# Altium project PCB_J-Link OB.PrjPcb
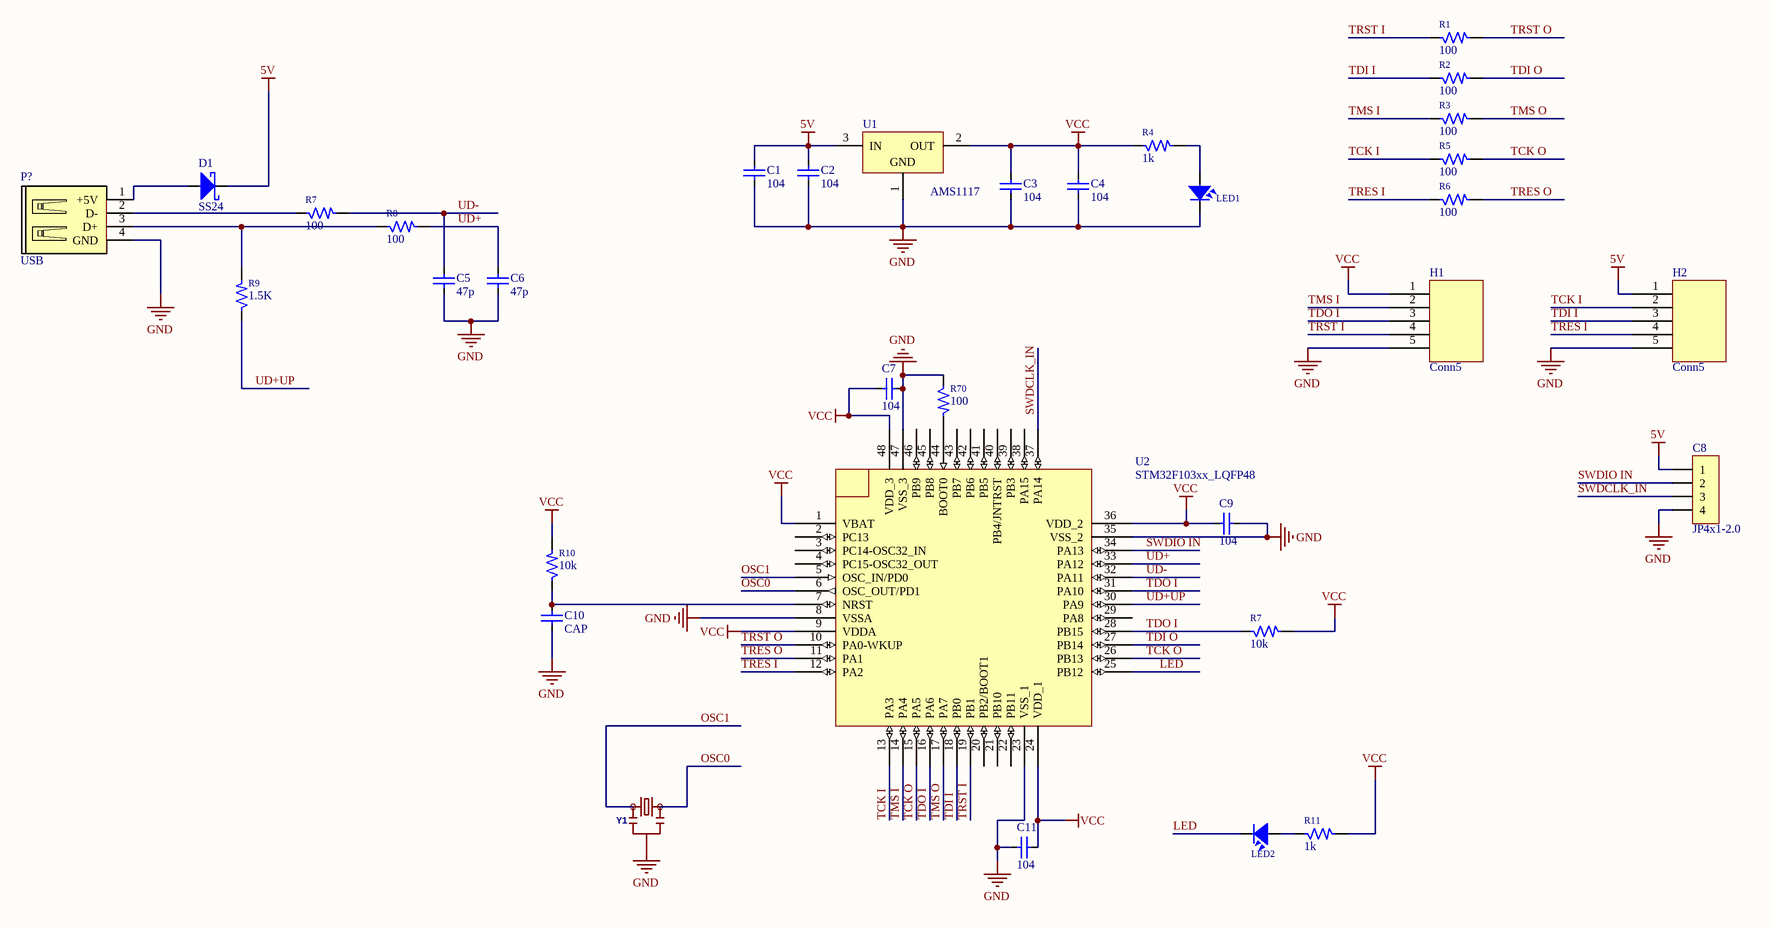
[diagram p0: J-Link OB.SchDoc]
1 sheet, 33 parts. Net scope: global (net labels, ports and power ports of the same name join across sheets).
Board file: J-Link.PcbDoc

## Sheet J-Link OB.SchDoc
size A2

### Parts
(Parts that share a designator on the sheet are numbered #1, #2 ... from top to bottom, then left to right.)
C1  104  [C 0805]
C2  104  [C 0805]
C3  104  [C 0805]
C4  104  [C 0805]
C5  47p  [C 0805]
C6  47p  [C 0805]
C7  104  [C 0805]
C8  JP4x1-2.0  [J4-C1T]
C9  104  [C 0805]
C10  CAP  [C 0805 INSTEK]
C11  104  [C 0805]
D1  SS24  [DO-214AC]
H1  Conn5  [CONN5]
H2  Conn5  [CONN5]
LED1  LED SMD  [SM-LED-0805-Blue]  (value not drawn)
LED2  LED SMD  [SM-LED-0805-Blue]  (value not drawn)
P?  USB  [USB TYPE-A Plug]
R1  100  [SM-RES-0805]
R2  100  [SM-RES-0805]
R3  100  [SM-RES-0805]
R4  1k  [SM-RES-0805]
R5  100  [SM-RES-0805]
R6  100  [SM-RES-0805]
R7#1  100  [SM-RES-0805]
R7#2  10k  [SM-RES-0805]
R8  100  [SM-RES-0805]
R9  1.5K  [SM-RES-0805]
R10  10k  [SM-RES-0805]
R11  1k  [SM-RES-0805]
R70  100  [SM-RES-0805]
U1  AMS1117  [SOT 223]
U2  STM32F103xx_LQFP48  [LQFP48]
Y1  (no value)  [RESONATOR-SMD-3.2X1.3]

### Nets
5V: C1.1 C2.1 C8.1 D1.2 H2.1 U1.3(IN)
GND: C1.2 C2.2 C3.2 C4.2 C5.1 C6.1 C7.2 C8.4 C9.1 C10.1 C11.1 H1.5 H2.5 LED1.2 P?.4(GND) R70.1 U1.1(GND) U2.8(VSSA) U2.23(VSS_1) U2.35(VSS_2) U2.47(VSS_3) Y1.2
VCC: C3.1 C4.1 C7.1 C9.2 C11.2 H1.1 R4.1 R7#2.2 R10.2 R11.2 U1.2(OUT) U2.1(VBAT) U2.9(VDDA) U2.24(VDD_1) U2.36(VDD_2) U2.48(VDD_3)
LED: LED2.2 U2.25(PB12)
OSC0: U2.6(OSC_OUT/PD1) Y1.3
OSC1: U2.5(OSC_IN/PD0) Y1.1
SWDCLK_IN: C8.3 U2.37(PA14)
SWDIO IN: C8.2 U2.34(PA13)
TCK I: H2.2 R5.1 U2.13(PA3)
TCK O: R5.2 U2.15(PA5) U2.26(PB13)
TDI I: H2.3 R2.1 U2.18(PB0)
TDI O: R2.2 U2.27(PB14)
TDO I: H1.3 R7#2.1 U2.16(PA6) U2.28(PB15) U2.31(PA10)
TMS I: H1.2 R3.1 U2.14(PA4)
TMS O: R3.2 U2.17(PA7)
TRES I: H2.4 R6.1 U2.12(PA2)
TRES O: R6.2 U2.11(PA1)
TRST I: H1.4 R1.1 U2.19(PB1)
TRST O: R1.2 U2.10(PA0-WKUP)
UD+: C6.2 R8.2 U2.33(PA12)
UD+UP: R9.1 U2.30(PA9)
UD-: C5.2 R7#1.2 U2.32(PA11)
NetC10_2: C10.2 R10.1 U2.7(NRST)
NetD1_1: D1.1 P?.1(+5V)
NetLED1_1: LED1.1 R4.2
NetLED2_1: LED2.1 R11.1
NetP?_2: P?.2(D-) R7#1.1
NetP?_3: P?.3(D+) R8.1 R9.2
NetR70_2: R70.2 U2.44(BOOT0)

Not connected (* = marked no-connect by the designer): U2 2(PC13) 3(PC14-OSC32_IN) 4(PC15-OSC32_OUT) 20(PB2/BOOT1) 21(PB10) 22(PB11) 29(PA8) 38(PA15) 39(PB3) 40(PB4/JNTRST) 41(PB5) 42(PB6) 43(PB7) 45(PB8) 46(PB9)

### Library data of the parts
C1-C7 C9-C11 = CAP_NP: Value: 0.1
C8 = JP4x1-2.0: WR-PHD 2.00 mm Socket Header; Manufacturer: W¨¹rth Elektronik eiSos GmbH; partNo: 62000411821; ComponentLink1 Description: Manufacturer; ComponentLink2 Description: Datasheet; NoPins: 04; Created Date: 2 April 2013; ComponentLink1URL: http://www.we-online.com; ComponentLink2URL: http://katalog.we-online.de/em/datasheet/6200xx11821.pdf; Created by: Karrer Zheng
D1 = Diode Schottky: Part Number: LED 3 ly Single Colour; Pricing: *
LED1 LED2 = LED SMD 0805
R1-R6 R7#1 R7#2 R8-R11 R70 = Res SMD: Res
U1 = AMS117
U2 = STM32F103xx_LQFP48: STM32 ARM-based 32-bit MCU with 64 Kbytes Flash, 48-pin LQFP, Industrial Temperature; Published: 30-May-2008; DatasheetVersion: rev6, Mar-2008; PackageVersion: Mar-2008; PackageReference: LQFP48; Publisher: Altium Limited; PackageDescription: 48-Pin Low-Profile Quad Flat Pack, 7 x 7 mm Body, 0.5 mm Pitch (LQFP48); ComponentLink1Description: Manufacturer Link; ComponentLink1URL: www.st.com/stm32; ComponentLink2Description: Datasheet; ComponentLink2URL: http://www.st.com/stonline/products/literature/ds/13587.pdf
Y1 = RESONATOR-8MHZSMD_3.2X1.3: PROD_ID: XTAL-08895